# Altium schematic sheet Nikola98p_M.2-5V-Mini-Irrigation-System__Altium__DEV-5V-Outside-Pump_2024-11-25.schdoc
size 330 x 302 mm
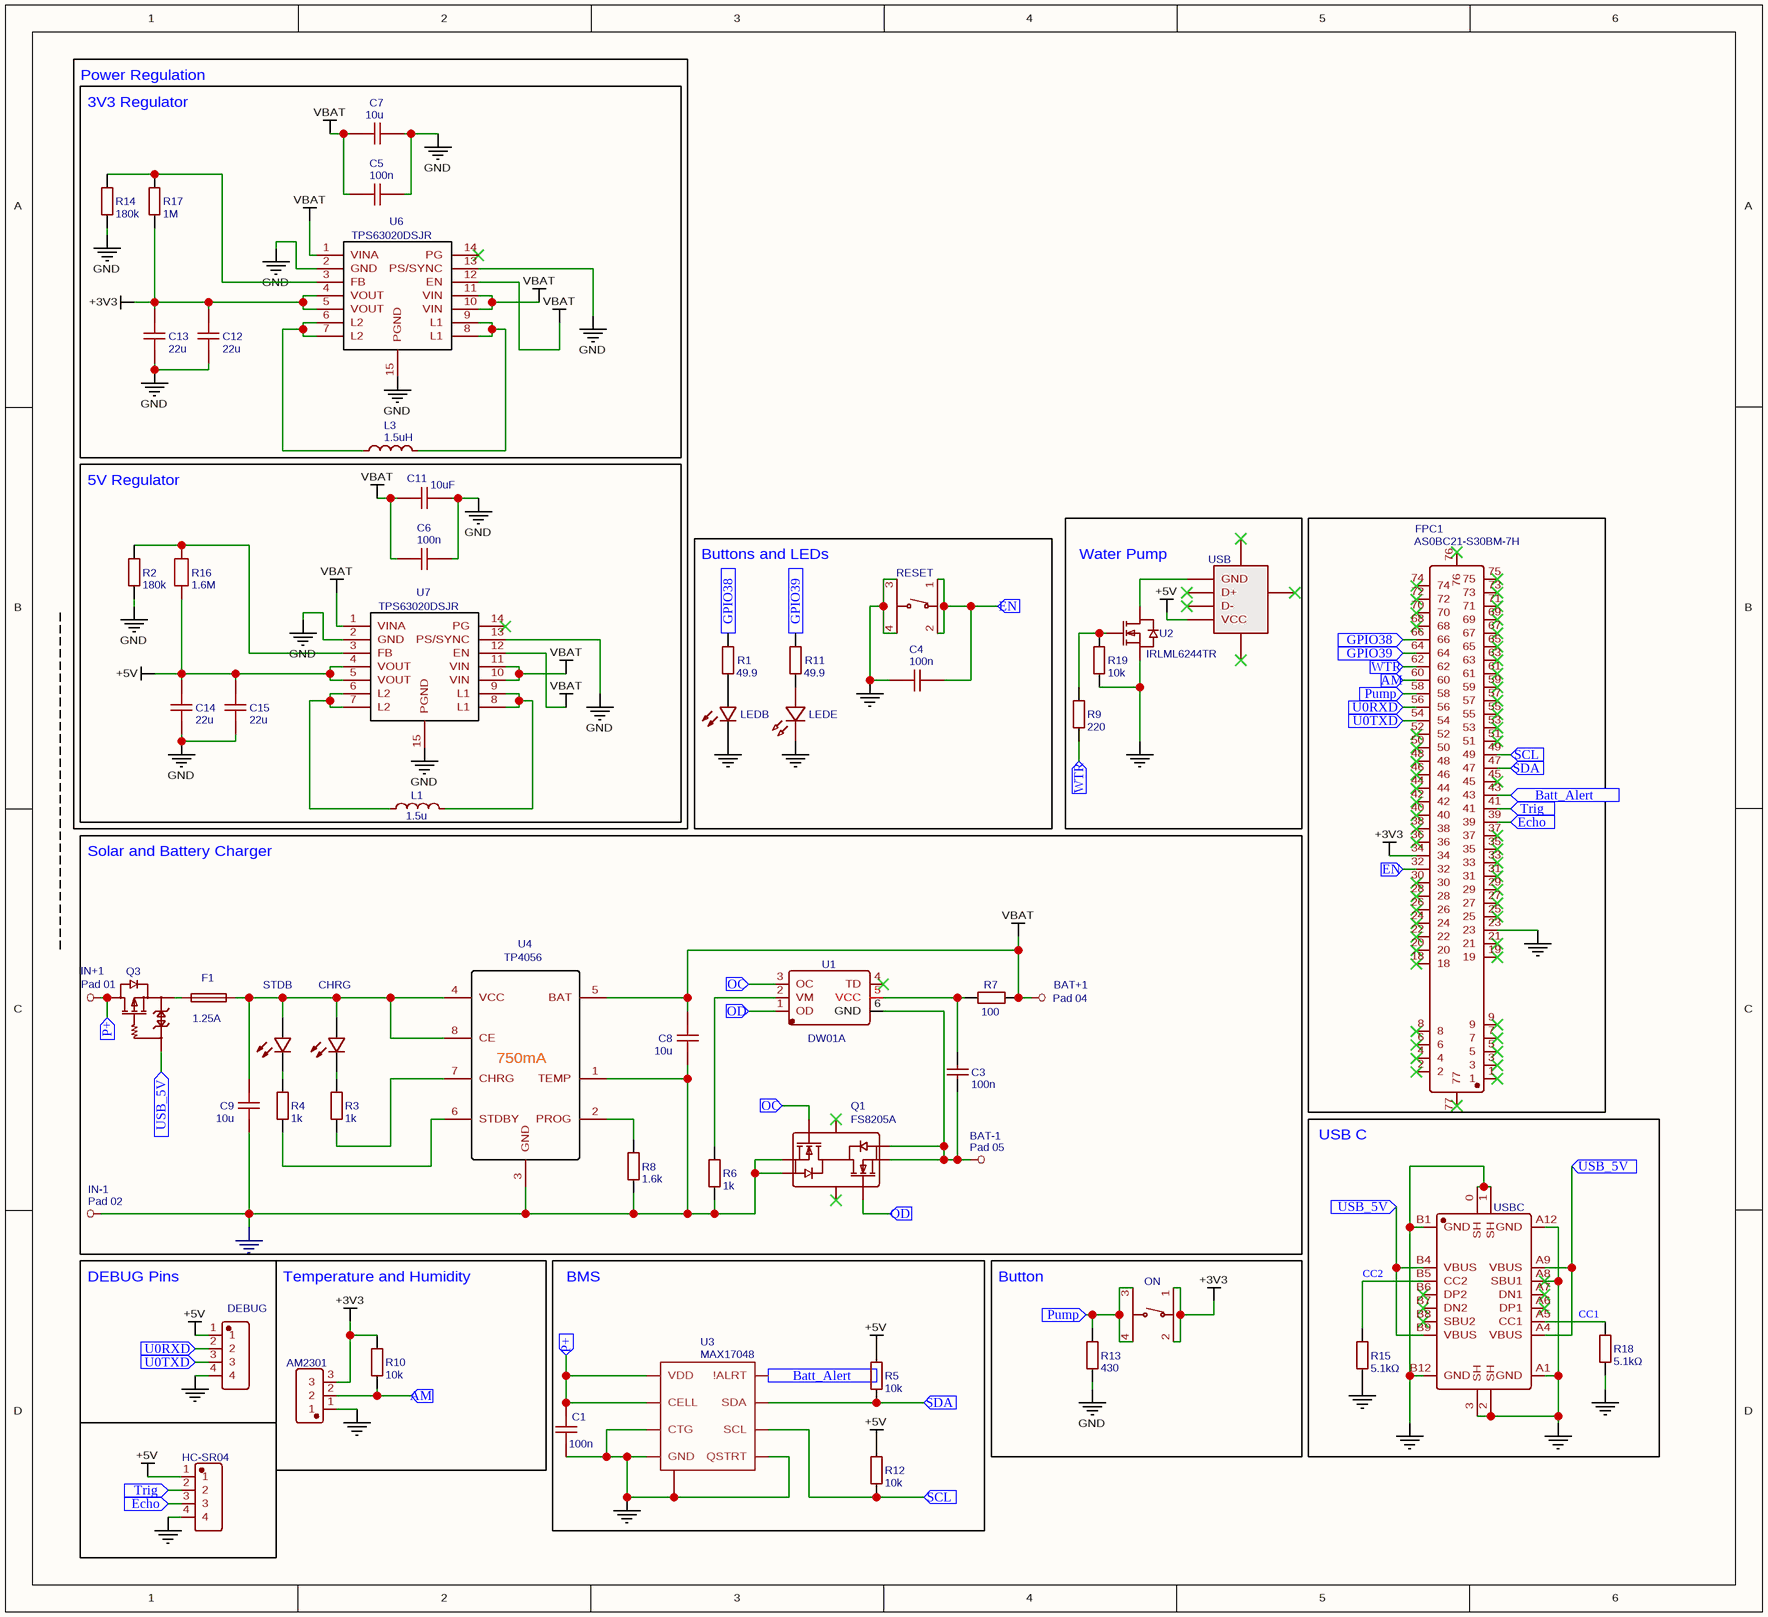
[diagram p0: Nikola98p_M.2-5V-Mini-Irrigation-System__Altium__DEV-5V-Outside-Pump_2024-11-25.schdoc]

## Parts
AM2301  1125  [CONN-TH_1125-1103S0S113CR01]  (value not drawn)
BAT+1  Pad 04  [CON_PAD_SQUARE_32MIL]
BAT-1  Pad 05  [CON_PAD_SQUARE_32MIL]
C1  100n  [C0603]
C3  100n  [C0603]
C4  100n  [C0603]
C5  100n  [C0603]
C6  100n  [C0603]
C7  10u  [C0603]
C8  10u  [C0603]
C9  10u  [C0603]
C11  10uF  [C0603]
C12  22u  [C0603]
C13  22u  [C0603]
C14  22u  [C0603]
C15  22u  [C0603]
CHRG  FC-DA1608BK-470H10  [LED0603-RD]  (value not drawn)
DEBUG  2.54-1*4P母  [HDR-TH_4P-P2.54-V-F]  (value not drawn)
F1  1.25A  [F0603]
FPC1  AS0BC21-S30BM-7H  [CONN-SMD_AS0BC21-S30BM-7H]
HC-SR04  2.54-1*4P母  [HDR-TH_4P-P2.54-V-F]  (value not drawn)
IN+1  Pad 01  [CON_PAD_SQUARE_32MIL]
IN-1  Pad 02  [CON_PAD_SQUARE_32MIL]
L1  1.5u  [IND-SMD_L7.2-W6.6_GPSR0730]
L3  1.5uH  [IND-SMD_L7.2-W6.6_GPSR0730]
LEDB  FC-DA1608BK-470H10  [LED0603-RD]  (value not drawn)
LEDE  XL-1608UGC-04  [LED0603-RD_GREEN]  (value not drawn)
ON  TS-1187A-B-A-B  [SW-SMD_4P-L5.1-W5.1-P3.70-LS6.5-TL-2]  (value not drawn)
Q1  FS8205A  [TSSOP-8_L4.4-W3.5-P0.65-LS6.4-BL]
Q3  NTA4151PT1G  [SOT-416_L1.6-W0.8-P1.00-LS1.6-BR]  (value not drawn)
R1  49.9  [R0603]
R2  180k  [R0603]
R3  1k  [R0603]
R4  1k  [R0603]
R5  10k  [R0603]
R6  1k  [R0603]
R7  100  [R0603]
R8  1.6k  [R0603]
R9  220  [R0603]
R10  10k  [R0603]
R11  49.9  [R0603]
R12  10k  [R0603]
R13  430  [R0603]
R14  180k  [R0603]
R15  5.1kΩ  [R0603]
R16  1.6M  [R0603]
R17  1M  [R0603]
R18  5.1kΩ  [R0603]
R19  10k  [R0603]
RESET  TS-1187A-B-A-B  [SW-SMD_4P-L5.1-W5.1-P3.70-LS6.5-TL-2]  (value not drawn)
STDB  FC-DA1608HRK-620D  [LED0603-RD_RED]  (value not drawn)
U1  DW01A  [SOT-23-6_L2.9-W1.6-P0.95-LS2.8-BL]
U2  IRLML6244TR  [SOT-23-3_L2.9-W1.3-P1.90-LS2.4-BR]
U3  MAX17048  [DFN-8]
U4  TP4056  [ESOP-8_L4.9-W3.9-P1.27-LS6.0-BL-EP]
U6  TPS63020DSJR  [VSON-14_L4.0-W3.0-P0.50-BL-EP_TI_DSJ]
U7  TPS63020DSJR  [VSON-14_L4.0-W3.0-P0.50-BL-EP_TI_DSJ]
USB  UBAS-4R-D14D-4D(LF)(SN)  [USB-A-TH_UBAS-4R-D14D-4D-LF-SN]  (value not drawn)
USBC  TYPE-C-31-M-12  [USB-C_SMD-TYPE-C-31-M-12]  (value not drawn)

## Blocks framed on the sheet
5V Regulator: C6 C11 C14 C15 L1 R2 R16 U7
Buttons and LEDs: C4 LEDB LEDE R1 R11 RESET
Water Pump: R9 R19 U2 USB
USB C: R15 R18 USBC
DEBUG Pins: DEBUG
Temperature and Humidity: AM2301 R10
BMS: C1 R5 R12 U3
Button: ON R13

## Ports
AM (in), Batt_Alert (in), Echo (in), EN (in), GPIO38 (in), GPIO39 (in), OC (in), OD (in), P+ (in), Pump (in), SCL (in), SDA (in), Trig (in), U0RXD (in), U0TXD (in), USB_5V (in), WTR (in)

## Nets
+3V3: AM2301.3 C12.2 C13.2 FPC1.34 ON.1(A) ON.2(B) R10.2 R17.1 U6.4(VOUT) U6.5(VOUT)
+5V: C14.2 C15.2 DEBUG.1 HC-SR04.1 R5.2 R12.2 R16.1 U7.4(VOUT) U7.5(VOUT) USB.1(VCC)
GND: AM2301.1 C1.1 C4.1 C5.2 C6.2 C7.2 C8.1 C9.1 C11.1 C12.1 C13.1 C14.1 C15.1 DEBUG.4 FPC1.23 HC-SR04.4 IN-1.P LEDB.1(-) LEDE.1(K) Q1.2(S1) Q1.3(S1) R2.1 R6.2 R8.1 R13.1 R14.1 R15.1 R18.1 R19.1 RESET.3(C) RESET.4(D) U2.2(S) U3.P$1(CTG) U3.P$4(GND) U3.P$6(QSTRT) U3.P$9(GND) U4.1(TEMP) U4.3(GND) U6.2(GND) U6.13(PS/SYNC) U6.15(PGND) U7.2(GND) U7.13(PS/SYNC) U7.15(PGND) USBC.0(SH) USBC.1(SH) USBC.2(SH) USBC.3(SH) USBC.A1(GND) USBC.A8(SBU1) USBC.A12(GND) USBC.B1(GND) USBC.B12(GND)
VBAT: BAT+1.P C5.1 C6.1 C7.1 C8.2 C11.2 R7.2 U4.5(BAT) U6.1(VINA) U6.10(VIN) U6.11(VIN) U6.12(EN) U7.1(VINA) U7.10(VIN) U7.11(VIN) U7.12(EN)
AM: AM2301.2 FPC1.60 R10.1 ; port AM
Batt_Alert: FPC1.43 U3.P$5(!ALRT) ; port Batt_Alert
CC1: R18.2 USBC.A5(CC1)
CC2: R15.2 USBC.B5(CC2)
Echo: FPC1.39 HC-SR04.3 ; port Echo
EN: C4.2 FPC1.32 RESET.1(A) RESET.2(B) ; port EN
GPIO38: FPC1.66 R1.2 ; port GPIO38
GPIO39: FPC1.64 R11.2 ; port GPIO39
OC: Q1.4(G1) U1.3(OC) ; port OC
OD: Q1.5(G2) U1.1(OD) ; port OD
P+: C1.2 IN+1.P Q3.3(D) U3.P$2(CELL) U3.P$3(VDD) ; port P+
Pump: FPC1.58 ON.3(C) ON.4(D) R13.2 ; port Pump
SCL: FPC1.49 R12.1 U3.P$7(SCL) ; port SCL
SDA: FPC1.47 R5.1 U3.P$8(SDA) ; port SDA
Trig: FPC1.41 HC-SR04.2 ; port Trig
U0RXD: DEBUG.2 FPC1.56 ; port U0RXD
U0TXD: DEBUG.3 FPC1.54 ; port U0TXD
USB_5V: Q3.1(G) USBC.A4(VBUS) USBC.A9(VBUS) USBC.B4(VBUS) USBC.B9(VBUS) ; port USB_5V
WTR: FPC1.62 R9.1 ; port WTR
NetBAT-1_P: BAT-1.P C3.1 Q1.6(S2) Q1.7(S2) U1.6(GND)
NetC3_2: C3.2 R7.1 U1.5(VCC)
NetC9_2: C9.2 CHRG.2(+) F1.2 STDB.2(A) U4.4(VCC) U4.8(CE)
NetCHRG_1: CHRG.1(-) R3.1
NetF1_1: F1.1 Q3.2(S)
NetL1_1: L1.1 U7.6(L2) U7.7(L2)
NetL1_2: L1.2 U7.8(L1) U7.9(L1)
NetL3_1: L3.1 U6.6(L2) U6.7(L2)
NetL3_2: L3.2 U6.8(L1) U6.9(L1)
NetLEDB_2: LEDB.2(+) R1.1
NetLEDE_2: LEDE.2(A) R11.1
NetR2_2: R2.2 R16.2 U7.3(FB)
NetR3_2: R3.2 U4.7(CHRG)
NetR4_1: R4.1 STDB.1(K)
NetR4_2: R4.2 U4.6(STDBY)
NetR6_1: R6.1 U1.2(VM)
NetR8_2: R8.2 U4.2(PROG)
NetR9_2: R9.2 R19.2 U2.1(G)
NetR14_2: R14.2 R17.2 U6.3(FB)
NetU2_3: U2.3(D) USB.4(GND)

Not connected (* = marked no-connect by the designer): FPC1 1* 2* 3* 4* 5* 6* 7* 8* 9* 18* 19* 20* 21* 22* 24* 25* 26* 27* 28* 29* 30* 31* 33* 35* 36* 37* 38* 40* 42* 44* 45* 46* 48* 50* 51* 52* 53* 55* 57* 59* 61* 63* 65* 67* 68* 69* 70* 71* 72* 73* 74* 75* 76* 77*; Q1 1(D12)* 8(D12)*; U1 4(TD)*; U6 14(PG)*; U7 14(PG)*; USB 2(D-)* 3(D+)* 5* 6* 7*; USBC A6(DP1)* A7(DN1)* B6(DP2)* B7(DN2)* B8(SBU2)*

## Notes on the sheet
- Power Regulation
- 3V3 Regulator
- Solar and Battery Charger
- (near U4) 750mA

## Library data of the parts
AM2301 = 1125: Manufacturer: Wcon(维峰电子); Manufacturer Part: 1125-1103S0S113CR01; Contributor: LCSC; Supplier: LCSC; Supplier Part: C721860; JLCPCB Part Class: Extended Part; spicePre: C; spiceSymbolName: 1125-1103S0S113CR01
BAT+1 = Pad 04: Contributor: DangerousPrototype; Manufacturer Part: ?; spicePre: T
BAT-1 = Pad 05: Contributor: DangerousPrototype; Manufacturer Part: ?; spicePre: T
C1 C4-C6 = 100n: Manufacturer: YAGEO(国巨); Manufacturer Part: CC0603KRX7R9BB104; nameAlias: Capacitance; Supplier: LCSC; Supplier Part: C14663; JLCPCB Part Class: Basic Part; spicePre: C; spiceSymbolName: CC0603KRX7R9BB104
C3 = 100n: Manufacturer: FH(风华); Manufacturer Part: 0603B104K500NT; nameAlias: Value; Supplier: LCSC; Supplier Part: C30926; JLCPCB Part Class: Extended Part; link: https://lcsc.com/eda_search?q=C30926&%26type=1&ref=editor; spicePre: C; spiceSymbolName: 0603B104K500NT
C7-C9 = 10u: Manufacturer: SAMSUNG(三星); Manufacturer Part: CL10A106KP8NNNC; nameAlias: Capacitance; Supplier: LCSC; Supplier Part: C19702; JLCPCB Part Class: Basic Part; spicePre: C; spiceSymbolName: CL10A106KP8NNNC
C11 = 10uF: Manufacturer: SAMSUNG(三星); Manufacturer Part: CL10A106KP8NNNC; nameAlias: Capacitance; Supplier: LCSC; Supplier Part: C19702; JLCPCB Part Class: Basic Part; spicePre: C; spiceSymbolName: CL10A106KP8NNNC
C12-C15 = 22u: Manufacturer: SAMSUNG(三星); Manufacturer Part: CL10A226MQ8NRNC; nameAlias: Capacitance; Supplier: LCSC; Supplier Part: C59461; JLCPCB Part Class: Basic Part; spicePre: C; spiceSymbolName: CL10A226MQ8NRNC
CHRG LEDB = FC-DA1608BK-470H10: Manufacturer: 国星光电; Manufacturer Part: NCD0603B1; Supplier: LCSC; Supplier Part: C84266; JLCPCB Part Class: Extended Part; link: https://lcsc.com/eda_search?q=C84266&%26type=1&ref=editor; spicePre: L; spiceSymbolName: FC-DA1608BK-470H10
DEBUG HC-SR04 = 2.54-1*4P母: Manufacturer: BOOMELE(博穆精密); Contributor: LCSC; Supplier: LCSC; Supplier Part: C2718488; Manufacturer Part: 2.54-1*4P母; JLCPCB Part Class: Extended Part; spicePre: H; spiceSymbolName: 2.54-1*4P母
F1 = 1.25A: Manufacturer: 大毅科技; Manufacturer Part: CF06V3T1R25; Contributor: LCSC; Supplier: LCSC; Supplier Part: C163109; JLCPCB Part Class: Extended Part; spicePre: F; spiceSymbolName: CF06V3T1R25
FPC1 = AS0BC21-S30BM-7H: Manufacturer: FOXCONN(富士康); Contributor: LCSC; Supplier: LCSC; Supplier Part: C2832351; Manufacturer Part: AS0BC21-S30BM-7H; JLCPCB Part Class: Extended Part; link: https://lcsc.com/eda_search?q=C2832351&%26type=1&ref=editor; spicePre: F; spiceSymbolName: AS0BC21-S30BM-7H
IN+1 = Pad 01: Contributor: DangerousPrototype; Manufacturer Part: ?; spicePre: T
IN-1 = Pad 02: Contributor: DangerousPrototype; Manufacturer Part: ?; spicePre: T
L1 = 1.5u: Manufacturer: SHOU HAN(首韩); Manufacturer Part: CYA0630-1.5UH; nameAlias: Value; Contributor: lcsc; Supplier: LCSC; Supplier Part: C5189745; JLCPCB Part Class: Extended Part; spicePre: L; spiceSymbolName: CYA0630-1.5UH
L3 = 1.5uH: Manufacturer: SHOU HAN(首韩); Manufacturer Part: CYA0630-1.5UH; nameAlias: Value; Contributor: lcsc; Supplier: LCSC; Supplier Part: C5189745; JLCPCB Part Class: Extended Part; spicePre: L; spiceSymbolName: CYA0630-1.5UH
LEDE = XL-1608UGC-04: Manufacturer: XINGLIGHT(成兴光); Contributor: lcsc; Supplier: LCSC; Supplier Part: C965804; Manufacturer Part: XL-1608UGC-04; JLCPCB Part Class: Extended Part; link: https://lcsc.com/eda_search?q=C965804&%26type=1&ref=editor; spicePre: L; spiceSymbolName: XL-1608UGC-04
ON RESET = TS-1187A-B-A-B: Manufacturer: XKB Connectivity(中国星坤); Contributor: LCSC; Supplier: LCSC; Supplier Part: C318884; Manufacturer Part: TS-1187A-B-A-B; JLCPCB Part Class: Basic Part; spicePre: S; spiceSymbolName: TS-1187A-B-A-B
Q1 = FS8205A: Manufacturer: FORTUNE; Supplier: LCSC; Manufacturer Part: FS8205A; LCSC Assembly: Yes; image: //image.lceda.cn/szlcsc/C16052.jpg; spicePre: Q; Supplier Part: C16052; JLCPCB Part Class: Extended Part
Q3 = NTA4151PT1G: Manufacturer: onsemi(安森美); Supplier: LCSC; Manufacturer Part: NTA4151PT1G; Supplier Part: C54876; JLCPCB Part Class: Extended Part; spicePre: Q; spiceSymbolName: NTA4151PT1G
R1 R11 = 49.9: Manufacturer: UNI-ROYAL(厚声); Manufacturer Part: 0603WAF499JT5E; nameAlias: Value; Supplier: LCSC; Supplier Part: C23185; JLCPCB Part Class: Basic Part; link: https://lcsc.com/eda_search?q=C23185&%26type=1&ref=editor; spicePre: R; spiceSymbolName: 0603WAF499JT5E
R2 R14 = 180k: Manufacturer: RALEC(旺诠); Manufacturer Part: RTT03184JTP; nameAlias: Value; Supplier: LCSC; Supplier Part: C103362; JLCPCB Part Class: Extended Part; spicePre: R; spiceSymbolName: RTT03184JTP
R3 R4 R6 = 1k: Manufacturer: UNI-ROYAL(厚声); Manufacturer Part: 0603WAF1001T5E; nameAlias: Value; Supplier: LCSC; Supplier Part: C21190; JLCPCB Part Class: Basic Part; link: https://lcsc.com/eda_search?q=C21190&%26type=1&ref=editor; spicePre: R; spiceSymbolName: 0603WAF1001T5E
R5 R10 R12 R19 = 10k: Manufacturer: UNI-ROYAL(厚声); Manufacturer Part: 0603WAF1002T5E; nameAlias: Value; Supplier: LCSC; Supplier Part: C25804; JLCPCB Part Class: Basic Part; spicePre: R; spiceSymbolName: 0603WAF1002T5E
  R5 R10 R12: link: https://lcsc.com/eda_search?q=C25804&%26type=1&ref=editor
R7 = 100: Manufacturer: UNI-ROYAL(厚声); Manufacturer Part: 0603WAF1000T5E; nameAlias: Resistance; Supplier: LCSC; Supplier Part: C22775; Resistance (Ohms): 100; JLCPCB Part Class: Basic Part; spicePre: R; spiceSymbolName: 0603WAF1000T5E
R8 = 1.6k: Manufacturer: UniOhm; Manufacturer Part: 0603WAJ0162T5E; nameAlias: Resistance (Ohms); Supplier: LCSC; Supplier Part: C25990; JLCPCB Part Class: Extended Part; spicePre: R; spiceSymbolName: 0603WAJ0162T5E
R9 = 220: Manufacturer: UNI-ROYAL(厚声); Manufacturer Part: 0603WAF2200T5E; nameAlias: Value; Supplier: LCSC; Supplier Part: C22962; JLCPCB Part Class: Basic Part; spicePre: R; spiceSymbolName: 0603WAF2200T5E
R13 = 430: Manufacturer: UNI-ROYAL(厚声); Manufacturer Part: 0603WAF4300T5E; nameAlias: Value; Supplier: LCSC; Supplier Part: C23170; JLCPCB Part Class: Basic Part; link: https://lcsc.com/eda_search?q=C23170&%26type=1&ref=editor; spicePre: R; spiceSymbolName: 0603WAF4300T5E
R15 R18 = 5.1kΩ: Manufacturer Part: 0603WAF5101T5E; Manufacturer: UNI-ROYAL(厚声); Resistance (Ohms): 5.1K; nameAlias: Resistance; Supplier: LCSC; Supplier Part: C23186; JLCPCB Part Class: Basic Part; spicePre: R; spiceSymbolName: 0603WAF5101T5E
R16 = 1.6M: Manufacturer: FOJAN(富捷); Manufacturer Part: FRC0603J165 TS; nameAlias: Value; Contributor: lcsc; Supplier: LCSC; Supplier Part: C2933272; JLCPCB Part Class: Extended Part; spicePre: R; spiceSymbolName: FRC0603J165 TS
R17 = 1M: Manufacturer: UNI-ROYAL(厚声); Manufacturer Part: 0603WAF1004T5E; nameAlias: Value; Supplier: LCSC; Supplier Part: C22935; JLCPCB Part Class: Basic Part; spicePre: R; spiceSymbolName: 0603WAF1004T5E
STDB = FC-DA1608HRK-620D: Manufacturer: 国星光电; Manufacturer Part: NCD0603R1; Supplier: LCSC; Supplier Part: C84263; JLCPCB Part Class: Extended Part; link: https://lcsc.com/eda_search?q=C84263&%26type=1&ref=editor; spicePre: L; spiceSymbolName: FC-DA1608HRK-620D
U1 = DW01A: Manufacturer: PUOLOP(迪浦); Contributor: LCSC; Supplier: LCSC; Supplier Part: C351410; Manufacturer Part: DW01A; JLCPCB Part Class: Extended Part; spicePre: U; spiceSymbolName: DW01A_C351410
U2 = IRLML6244TR: Manufacturer: UMW(广东友台半导体); Manufacturer Part: IRLML6244TR(UMW); Contributor: lcsc; Supplier: LCSC; Supplier Part: C5354986; spicePre: U; spiceSymbolName: IRLML6244TR(UMW)
U3 = MAX17048: description: Micropower 1-Cell Li+ ModelGauge; timeStamp: 1468591666; spicePre: U; spiceSymbolName: MAX17048; Supplier Part: C2682616
U4 = TP4056: Manufacturer: TOPPOWER(南京拓微); Manufacturer Part: TP4056-42-ESOP8; Contributor: Guest; Supplier: LCSC; LCSC Assembly: Yes; image: //image.lceda.cn/szlcsc/C16581.jpg; spicePre: U; Supplier Part: C16581; JLCPCB Part Class: Basic Part
U6 U7 = TPS63020DSJR: Manufacturer: TI(德州仪器); Supplier: LCSC; Manufacturer Part: TPS63020DSJR; Supplier Part: C15483; JLCPCB Part Class: Extended Part; link: https://lcsc.com/eda_search?q=C15483&%26type=1&ref=editor; spicePre: U; spiceSymbolName: TPS63020DSJR
USB = UBAS-4R-D14D-4D(LF)(SN): Manufacturer: JST; Contributor: LCSC; Supplier: LCSC; Supplier Part: C265461; Manufacturer Part: UBAS-4R-D14D-4D(LF)(SN); JLCPCB Part Class: Extended Part; link: https://lcsc.com/eda_search?q=C265461&%26type=1&ref=editor; spicePre: U; spiceSymbolName: UBAS-4R-D14D-4D(LF)(SN)
USBC = TYPE-C-31-M-12: Manufacturer: 韩国韩荣; Contributor: LCSC; Supplier: LCSC; Supplier Part: C165948; Manufacturer Part: TYPE-C-31-M-12; JLCPCB Part Class: Extended Part; spicePre: U; spiceSymbolName: TYPE-C-31-M-12